# EAGLE design gameshield (EAGLE 5.11)
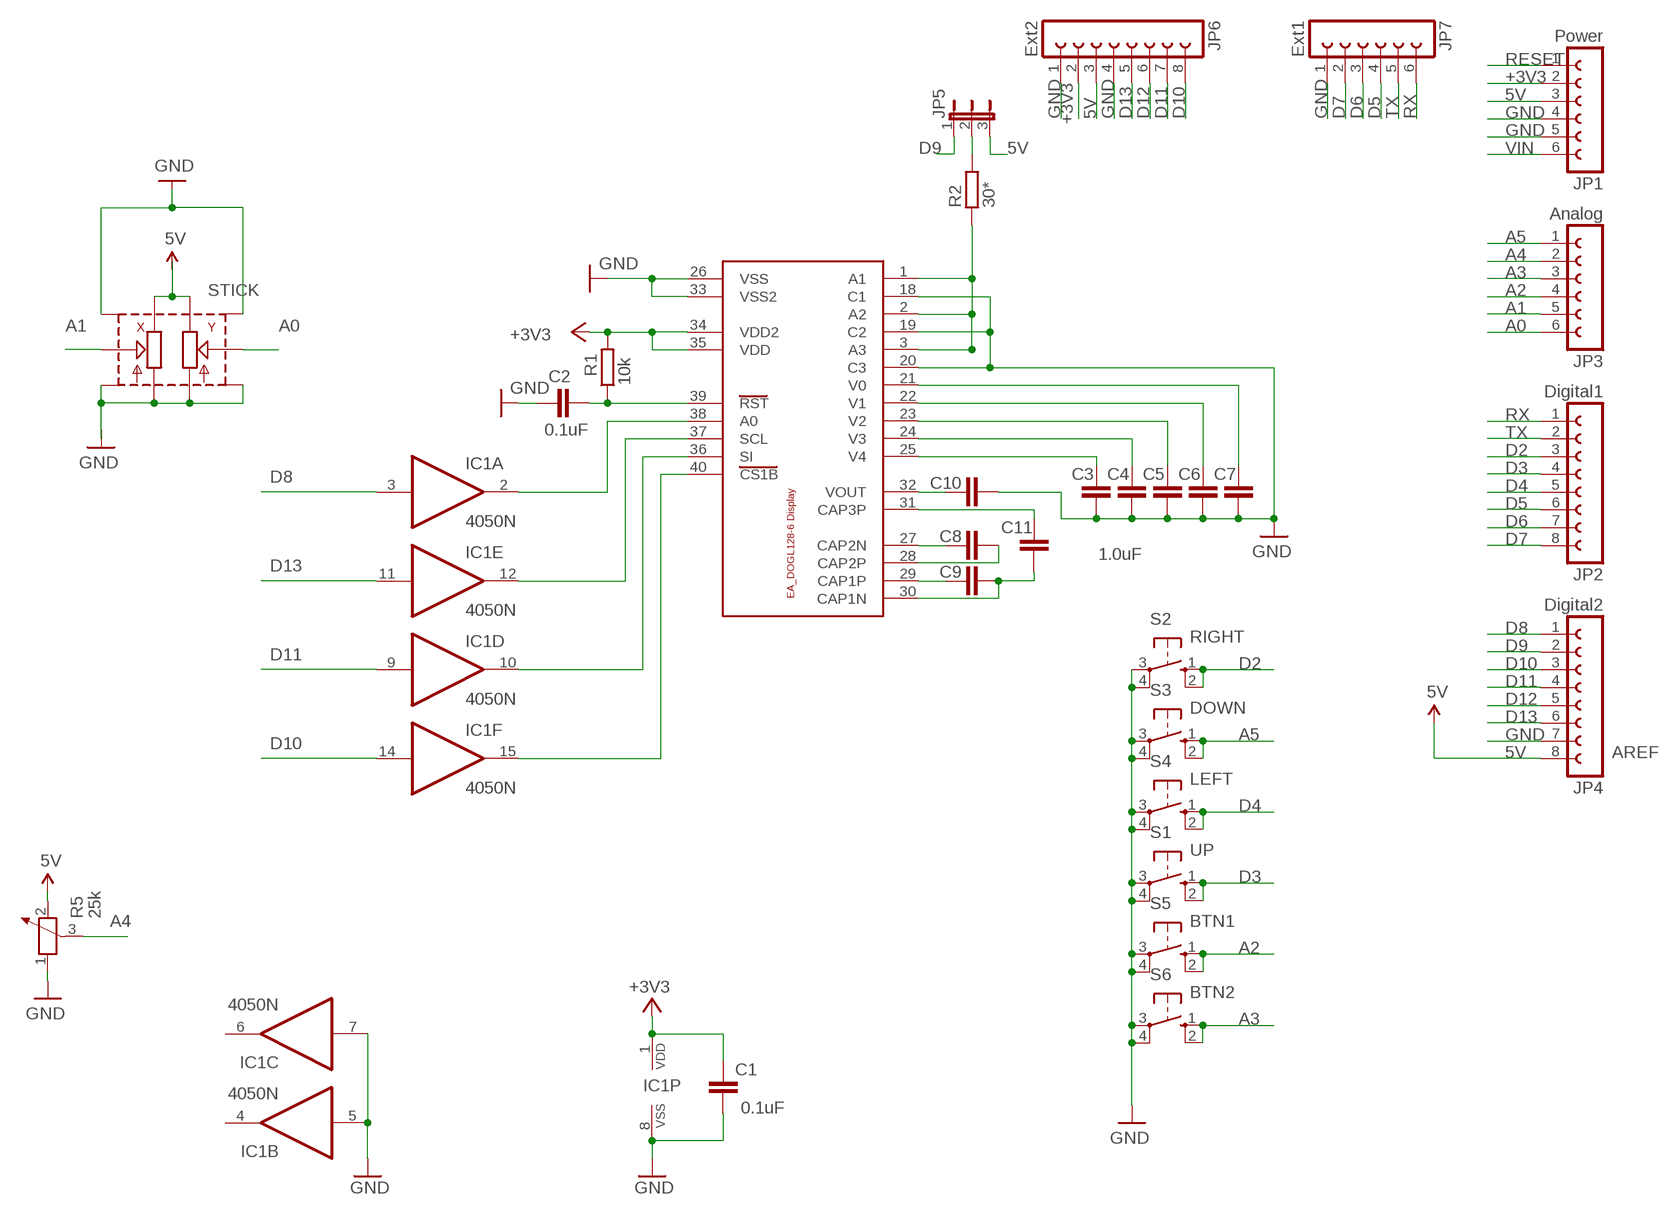
[diagram p0: schematic, sheet 1]

## Parts
C1  0.1uF  C-EU050-025X075  [C050-025X075]
C2  0.1uF  C-EU050-025X075  [C050-025X075]
C3  1.0uF  C-EU050-025X075  [C050-025X075]
C4  1.0uF  C-EU050-025X075  [C050-025X075]
C5  1.0uF  C-EU050-025X075  [C050-025X075]
C6  1.0uF  C-EU050-025X075  [C050-025X075]
C7  1.0uF  C-EU050-025X075  [C050-025X075]
C8  1.0uF  C-EU050-025X075  [C050-025X075]
C9  1.0uF  C-EU050-025X075  [C050-025X075]
C10  1.0uF  C-EU050-025X075  [C050-025X075]
C11  1.0uF  C-EU050-025X075  [C050-025X075]
IC1  4050N  [DIL16]
JP1  Power  FE06-1  [FE06]
JP2  Digital1  FE08-1  [FE08]
JP3  Analog  FE06-1  [FE06]
JP4  Digital2  FE08-1  [FE08]
JP5  JP2E  [JP2]
JP6  Ext2  FE08-1  [FE08]
JP7  Ext1  FE06-1  [FE06]
R1  10k  R-EU_0207/10  [0207/10]
R2  30*  R-EU_0207/10  [0207/10]
R5  25k  POTENTIOMETER_PT-6  [PT-6]
S1  UP  10-XX  [B3F-10XX]
S2  RIGHT  10-XX  [B3F-10XX]
S3  DOWN  10-XX  [B3F-10XX]
S4  LEFT  10-XX  [B3F-10XX]
S5  BTN1  10-XX  [B3F-10XX]
S6  BTN2  10-XX  [B3F-10XX]
STICK  JOYSTICK  [JOYSTICK]
U$1  EA_DOGL128-6  [EA_DOGL128-6]

## Nets
5V [power]: JP1.3 JP4.8 JP5.3 JP6.3 R5.2 STICK.X3 STICK.Y3
+3V3: C1.2 IC1.1(P:VDD) JP1.2 JP6.2 R1.2 U$1.34(VDD2) U$1.35(VDD)
A0: JP3.6 STICK.Y2
A1: JP3.5 STICK.X2
A2: JP3.4 S5.1(S) S5.2(S1)
A3: JP3.3 S6.1(S) S6.2(S1)
A4: JP3.2 R5.3
A5: JP3.1 S3.1(S) S3.2(S1)
D2: JP2.3 S2.1(S) S2.2(S1)
D3: JP2.4 S1.1(S) S1.2(S1)
D4: JP2.5 S4.1(S) S4.2(S1)
D5: JP2.6 JP7.4
D6: JP2.7 JP7.3
D7: JP2.8 JP7.2
D8: IC1.3(A:I) JP4.1
D9: JP4.2 JP5.1
D10: IC1.14(F:I) JP4.3 JP6.8
D11: IC1.9(D:I) JP4.4 JP6.7
D12: JP4.5 JP6.6
D13: IC1.11(E:I) JP4.6 JP6.5
GND [power]: C1.1 C2.1 C3.1 C4.1 C5.1 C6.1 C7.1 C10.1 IC1.5(B:I) IC1.7(C:I) IC1.8(P:VSS) JP1.4 JP1.5 JP4.7 JP6.1 JP6.4 JP7.1 R5.1 S1.3(P) S1.4(P1) S2.3(P) S2.4(P1) S3.3(P) S3.4(P1) S4.3(P) S4.4(P1) S5.3(P) S5.4(P1) S6.3(P) S6.4(P1) STICK.CASE1 STICK.CASE2 STICK.CASE3 STICK.CASE4 STICK.X1 STICK.Y1 U$1.18(C1) U$1.19(C2) U$1.20(C3) U$1.26(VSS) U$1.33(VSS2)
N$1: JP5.2 R2.2
N$2: C2.2 R1.1 U$1.39(RST)
N$3: IC1.2(A:O) U$1.38(A0)
N$4: IC1.12(E:O) U$1.37(SCL)
N$5: IC1.10(D:O) U$1.36(SI)
N$7: R2.1 U$1.1(A1) U$1.2(A2) U$1.3(A3)
N$8: C3.2 U$1.25(V4)
N$9: C4.2 U$1.24(V3)
N$10: C5.2 U$1.23(V2)
N$11: C6.2 U$1.22(V1)
N$12: C7.2 U$1.21(V0)
N$13: C11.2 U$1.31(CAP3P)
N$14: C8.2 U$1.27(CAP2N)
N$15: C8.1 U$1.28(CAP2P)
N$16: C9.2 U$1.29(CAP1P)
N$17: C9.1 C11.1 U$1.30(CAP1N)
N$18: C10.2 U$1.32(VOUT)
N$19: IC1.15(F:O) U$1.40(CS1B)
RESET: JP1.1
RX: JP2.1 JP7.6
TX: JP2.2 JP7.5
VIN [power]: JP1.6
Unconnected: IC1.4(B:O) IC1.6(C:O)

## Notes on the sheet
- AREF
- 0.1uF

## Library data of the parts
C1-C11 = resistor:C-EU: CAPACITOR, European symbol
IC1 = 40xx:4050: Hex non-inverting BUFFER
JP1 JP3 JP7 = con-lsta:FE06-1: FEMALE HEADER
JP2 JP4 JP6 = con-lsta:FE08-1: FEMALE HEADER
JP5 = jumper:JP2E: JUMPER
R1 R2 = resistor:R-EU_: RESISTOR, European symbol
R5 = poti:POTENTIOMETER_: Potentiometer
S1-S6 = switch-omron:10-XX: OMRON SWITCH
STICK = stick:JOYSTICK
U$1 = ea_dogl128:EA_DOGL128-6

## Net classes
1 power: width 0.254 mm

## Board
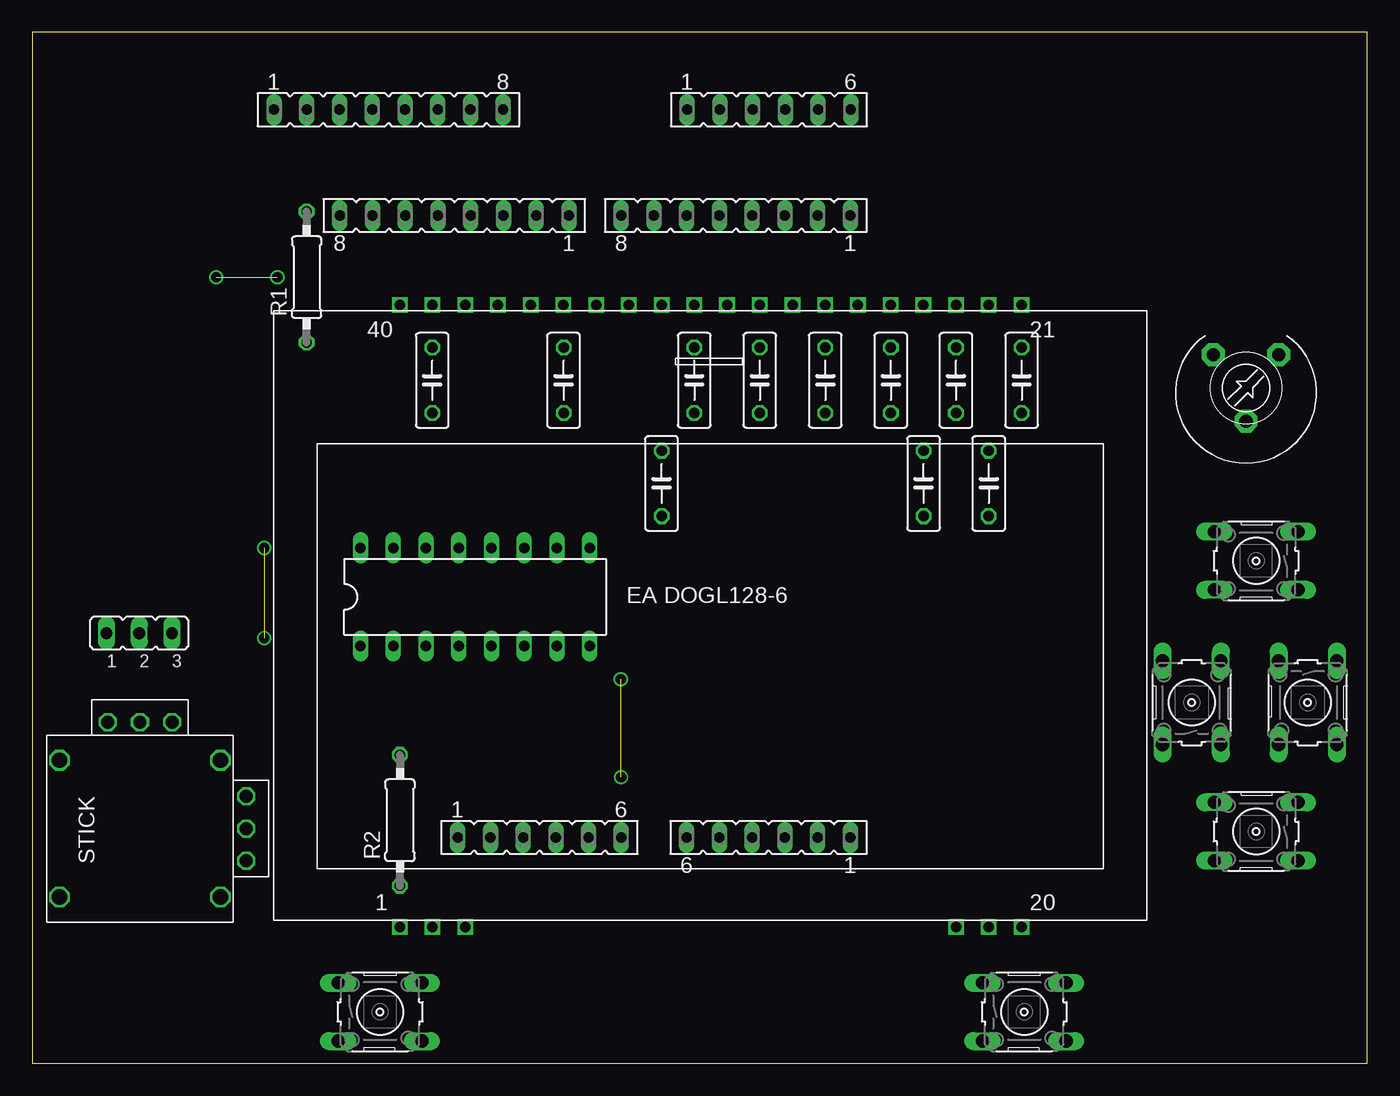
[diagram p1: board, top side]
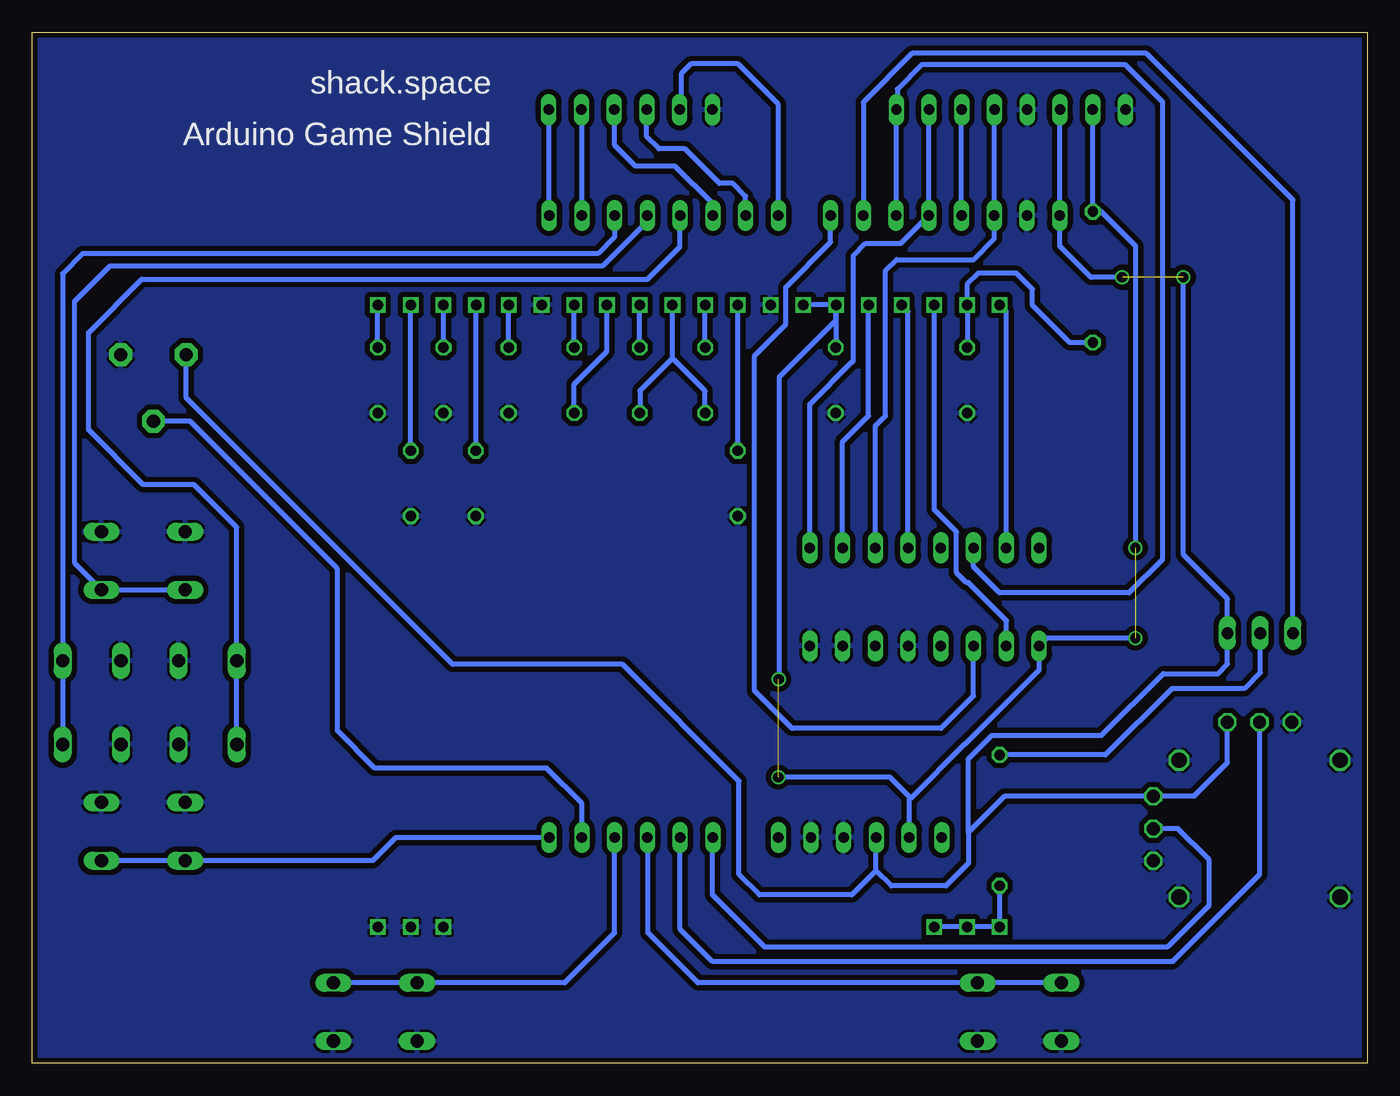
[diagram p2: board, bottom side, seen from below]

Size 103.62 x 80.01 mm. Coordinates in mm from the lower left corner, seen from the top.
Outline: 0,0 103.62,0 103.62,80.01 0,80 0,0
Copper layers (1*16): Top 0.035mm / dielectric 1.5mm / Bottom 0.035mm
Design rules "PCB-POOL Standard": minimum track width 0.15mm, minimum drill 0.3mm, track to track 0.15mm, track to pad 0.15mm, pad to pad 0.15mm, via to via 0.15mm, smd to smd 0.15mm, copper to edge 0.3mm, drill to drill 0.2mm, minimum pad ring 0.2mm, minimum via ring 0.15mm, stop-mask expansion 0.075mm, vias tented up to drill 0mil, thermal gap 0.2mm

### Footprints (pad centres in the part's own frame; a part is rotated, then mirrored left to right if it is on the bottom)
C050-025X075 = drill 0.813 octagon: 1 -2.54,0; 2 2.54,0
DIL16 = drill 0.813 long: 1 -8.89,-3.81; 2 -6.35,-3.81; 3 -3.81,-3.81; 4 -1.27,-3.81; 5 1.27,-3.81; 6 3.81,-3.81; 7 6.35,-3.81; 8 8.89,-3.81; 9 8.89,3.81; 10 6.35,3.81; 11 3.81,3.81; 12 1.27,3.81; 13 -1.27,3.81; 14 -3.81,3.81; 15 -6.35,3.81; 16 -8.89,3.81
FE06 = drill 0.813 long: 1 -6.35,0; 2 -3.81,0; 3 -1.27,0; 4 1.27,0; 5 3.81,0; 6 6.35,0
FE08 = drill 0.813 long: 1 -8.89,0; 2 -6.35,0; 3 -3.81,0; 4 -1.27,0; 5 1.27,0; 6 3.81,0; 7 6.35,0; 8 8.89,0
JP2 = drill 0.914 long: 1 -2.54,0; 2 0,0; 3 2.54,0
0207/10 = drill 0.813 octagon: 1 -5.08,0; 2 5.08,0
PT-6 = drill 1.016 pad 1.778 octagon: 1 -2.54,-2.58; 2 2.54,-2.58; 3 0,2.58
B3F-10XX = drill 1.016 long: 1 -3.251,2.261; 2 3.251,2.261; 3 -3.251,-2.261; 4 3.251,-2.261
JOYSTICK = drill 1.2 octagon: CASE1 6.25,-5.3; CASE2 6.25,5.3; CASE3 -6.25,5.3; CASE4 -6.25,-5.3 | drill 1 octagon: X1 -2.5,8.25; X2 0,8.25; X3 2.5,8.25; Y1 8.25,-2.5; Y2 8.25,0; Y3 8.25,2.5
EA_DOGL128-6 = drill 0.813 square: 1 0,0; 2 2.54,0; 3 5.08,0; 18 43.18,0; 19 45.72,0; 20 48.26,0; 21 48.26,48.26; 22 45.72,48.26; 23 43.18,48.26; 24 40.64,48.26; 25 38.1,48.26; 26 35.56,48.26; 27 33.02,48.26; 28 30.48,48.26; 29 27.94,48.26; 30 25.4,48.26; 31 22.86,48.26; 32 20.32,48.26; 33 17.78,48.26; 34 15.24,48.26; 35 12.7,48.26; 36 10.16,48.26; 37 7.62,48.26; 38 5.08,48.26; 39 2.54,48.26; 40 0,48.26

### Placement (x,y rotation side)
C1  41.25,53 90 top
C2  31.05,53 90 top
C3  66.65,53 90 top
C4  69.19,45 90 top
C5  71.7,53 90 top
C6  74.25,45 90 top
C7  76.8,53 90 top
C8  61.56,53 90 top
C9  56.47,53 90 top
C10  48.85,45 90 top
C11  51.39,53 90 top
IC1  34.37,36.2 0 top
JP1  39.37,17.54 0 top
JP2  54.61,65.8 180 top
JP3  57.15,17.54 180 top
JP4  32.77,65.8 180 top
JP5  8.31,33.38 0 top
JP6  27.66,74 0 top
JP7  57.19,74 0 top
R1  21.3,61.01 90 top
R2  28.54,18.87 90 top
R5  94.21,52.41 180 top
S1  95,39 180 top
S2  99,28 270 top
S3  95,18 180 top
S4  90,28 90 top
S5  27,4 0 top
S6  77,4 0 top
STICK  8.36,18.23 0 top
U$1  28.53,10.6 0 top

### Tracks (layer width: path | path; a pad name or v marks a point on that pad's centre or on a via)
5V  (via drill 0.8 pad 0.81)  (1 unrouted)
  Bottom 0.406: JP6.3 23.88,73.97 JP4.8 23.86,65.79 23.86,63.42 21.44,61 v19.02,61 | v14.28,61 14.28,39.48 10.85,36.05 JP5.3 10.85,30.98 11.57,30.25 15.84,30.25 20.64,25.45 29.15,25.45 30.96,23.64 30.96,17.93 | 30.96,17.93 30.96,15.53 32.7,13.79 36.95,13.79 38.12,14.96 | 38.12,14.96 38.12,17.52 JP1.3 | R5.2 91.67,51.65 70.99,30.96 57.83,30.96 48.76,21.9 48.76,14.65 47.19,13.07 40.01,13.07 38.12,14.96 | 30.96,17.93 28.16,20.73 STICK.Y3 13.46,20.74 10.86,23.34 STICK.X3
+3V3  (via drill 0.8 pad 0.61)  (2 unrouted)
  Bottom 0.406: JP6.2 R1.2 20.64,66.08 17.98,63.42 17.98,40.02 v18,40 | C1.2 41.25,58.84 U$1.35 | U$1.35 U$1.34 | v18,33 24.87,33 IC1.1 25.48,30.51 31.24,24.75 31.27,24.75 35.44,20.59 | JP1.2 35.56,20.46 35.44,20.59 | v45.71,22.21 37.06,22.21 35.44,20.59 | U$1.35 41.23,57.68 45.64,53.27 45.64,29.86 v45.69,29.81
A0
  Bottom 0.406: STICK.Y2 14.7,18.23 12.28,15.8 12.28,12.28 15.53,9.03 46.76,9.03 50.81,13.07 50.81,17.53 JP3.6
A1
  Bottom 0.406: STICK.X2 8.36,14.66 15.12,7.9 50.81,7.9 53.34,10.43 JP3.5
A2
  Bottom 0.406: S5.1 S5.2 51.96,6.26 55.84,10.14 55.84,17.5 JP3.4
A3
  Bottom 0.406: S6.2 S6.1 62.3,6.26 58.42,10.14 JP3.3
A4
  Bottom 0.406: R5.3 91.38,49.83 79.92,38.38 79.92,25.8 77.04,22.91 63.69,22.91 60.95,20.18 JP3.2
A5
  Bottom 0.406: S3.1 S3.2 77.2,15.74 75.44,17.5 63.54,17.5 JP3.1
D2
  Bottom 0.406: S2.2 S2.1 101.26,61.29 99.72,62.83 59.71,62.83 58.41,64.12 JP2.3
D3
  Bottom 0.406: S1.2 S1.1 100.36,38.85 100.36,59.1 97.6,61.86 59.38,61.86 55.88,65.36 JP2.4
D4
  Bottom 0.406: S4.1 S4.2 87.74,41.59 91.06,44.91 95.01,44.91 99.25,49.15 99.25,56.71 95.11,60.85 55.86,60.85 53.35,63.36 JP2.5
D5
  Bottom 0.406: JP2.6 50.8,66.69 53.74,69.62 56.8,69.62 58.42,71.25 58.42,73.97 JP7.4
D6
  Bottom 0.406: JP2.7 48.26,67.3 49.24,68.28 50.29,68.28 52.98,70.96 54.99,70.96 55.94,71.91 55.94,73.98 JP7.3
D7
  Bottom 0.406: JP2.8 45.72,74.42 48.86,77.56 52.49,77.56 53.26,76.79 53.26,74.11 JP7.2
D8
  Bottom 0.406: IC1.3 30.56,28.51 33.08,26 44.65,26 47.56,28.91 47.56,54.91 45.12,57.35 45.14,57.36 45.14,60.24 41.66,63.72 JP4.1
D9
  Bottom 0.406: JP5.1 5.77,67 17.15,78.38 35.33,78.38 39.12,74.58 JP4.2
D10
  Bottom 0.406: JP4.3 36.58,73.97 JP6.8 36.49,74.06 36.49,75.6 34.61,77.47 18.76,77.47 15.88,74.59 15.88,39.14 18.5,36.51 28.55,36.51 30.56,38.52 IC1.14
D11
  Bottom 0.406: JP6.7 34.04,73.97 JP4.4 36.21,63.62 38.95,63.62 39.89,62.69 39.89,54.51 40.01,54.39 40.02,54.39 43.26,51.15 IC1.9
D12
  Bottom 0.406: JP4.5 31.5,73.97 JP6.6
D13
  Bottom 0.406: JP6.5 28.96,73.97 JP4.6 28.95,63.98 30.55,62.38 36.54,62.38 37.39,61.52 37.39,50.25 37.52,50.11 37.54,50.11 38.18,49.47 IC1.11
GND
  pour Bottom (isolate 0.406): 0.35,-0.38 -0.17,-0.51 -0.19,80.2 103.71,80.2 103.79,-0.35
N$1
  Bottom 0.406: R2.2 20.32,23.95 15.19,29.07 9.55,29.07 8.29,30.34 8.29,33.36 JP5.2
N$2
  Bottom 0.406: C2.2 31.05,58.83 U$1.39 31.06,58.86 31.06,60.45 30.19,61.33 27.24,61.33 25.99,60.08 25.99,58.83 23.09,55.92 R1.1
N$3
  Bottom 0.406: U$1.38 33.61,42.96 31.89,41.24 31.89,38.09 31.1,37.3 30.95,37.3 28,34.35 28,32.41 IC1.2
N$4
  Bottom 0.406: IC1.12 35.64,58.35 U$1.37
N$5
  Bottom 0.406: IC1.10 40.72,48.24 38.71,50.25 38.71,58.83 U$1.36
N$7
  Bottom 0.406: R2.1 28.53,13.78 U$1.1 U$1.2 U$1.3
N$8
  Bottom 0.406: C3.2 66.65,58.84 U$1.25
N$9
  Bottom 0.406: C4.2 69.19,58.84 U$1.24
N$10
  Bottom 0.406: C5.2 71.7,58.84 U$1.23
N$11
  Bottom 0.406: C6.2 U$1.22
N$12
  Bottom 0.406: C7.2 U$1.21
N$13
  Bottom 0.406: C11.2 U$1.31
N$14
  Bottom 0.406: C8.2 U$1.27
N$15
  Bottom 0.406: C8.1 61.56,52.7 59.01,55.25 U$1.28
N$16
  Bottom 0.406: C9.2 U$1.29
N$17
  Bottom 0.406: 53.93,54.73 U$1.30 | 53.93,54.73 56.46,52.2 C9.1 | C11.1 51.39,52.19 53.93,54.73
N$18
  Bottom 0.406: C10.2 U$1.32
N$19
  Bottom 0.406: IC1.15 28.02,58.35 U$1.40
RX
  Bottom 0.406: JP2.1 63.5,73.96 JP7.6
TX
  Bottom 0.406: JP2.2 60.96,73.96 JP7.5

### Text on the board
bNames: shack.space | Arduino Game Shield